# Altium schematic sheet Esquemático.SchDoc
size A4
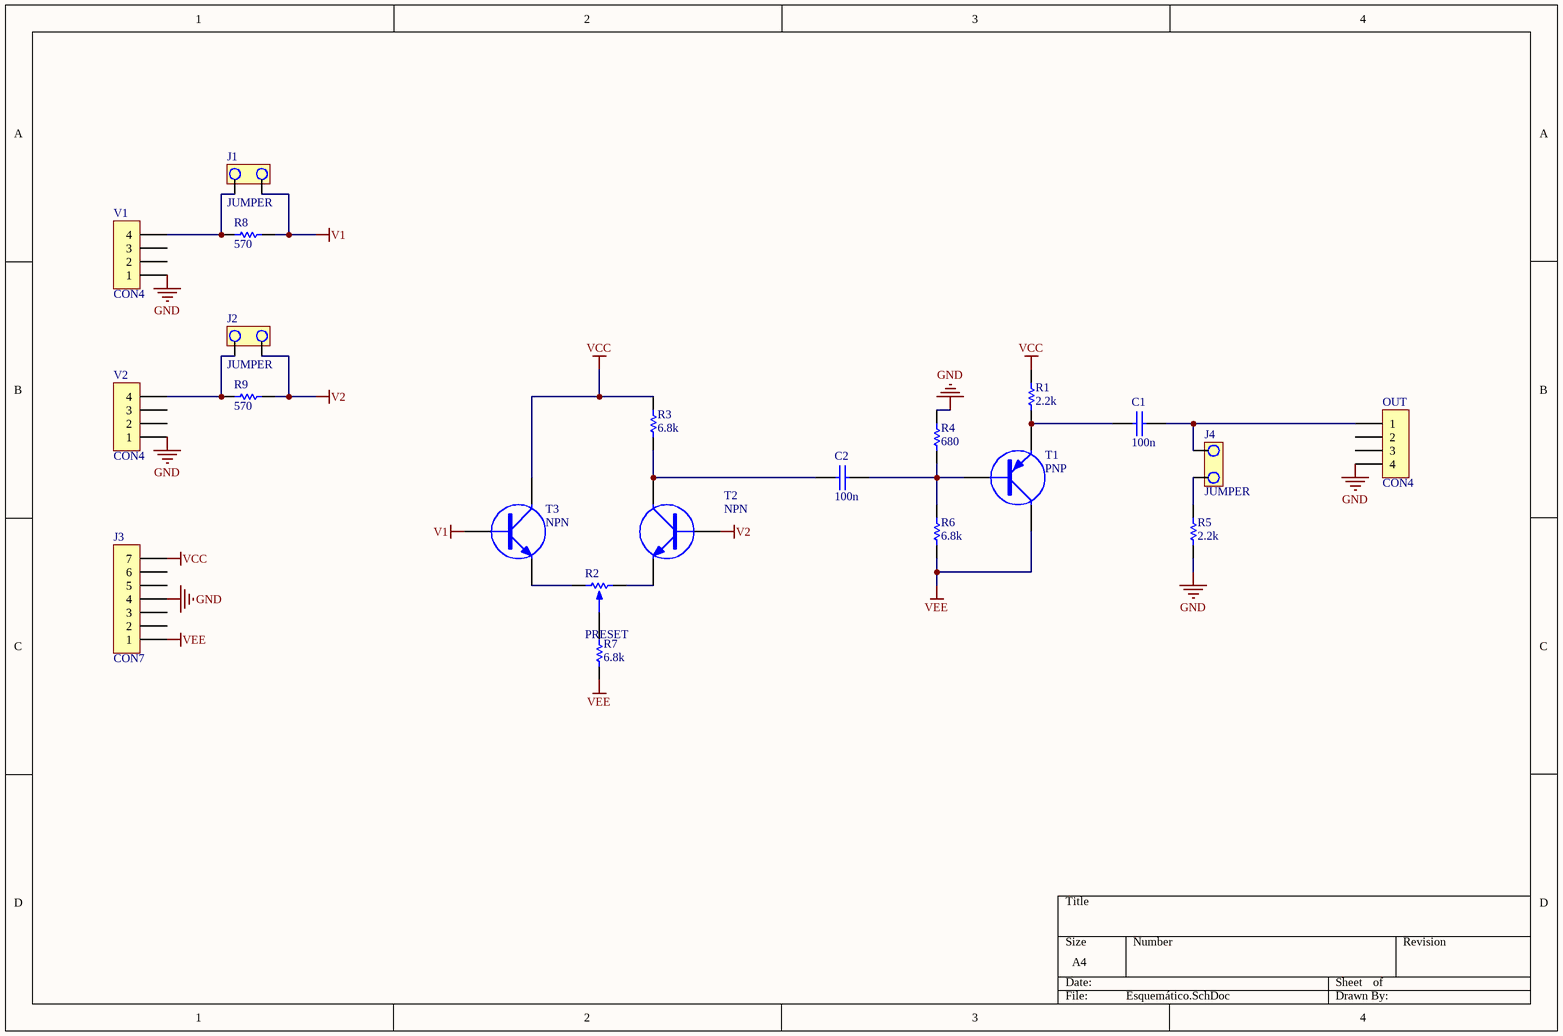
[diagram p0: Esquemático.SchDoc]

## Parts
C1  100n  [CAP200]
C2  100n  [CAP200]
J1  JUMPER  [JUMPER2]
J2  JUMPER  [JUMPER2]
J3  CON7  [SIP7]
J4  JUMPER  [JUMPER2]
OUT  CON4  [SIP4]
R1  2.2k  [RES400]
R2  PRESET  [PRESET V]
R3  6.8k  [RES400]
R4  680  [RES400]
R5  2.2k  [RES400]
R6  6.8k  [RES400]
R7  6.8k  [RES400]
R8  570  [RES400]
R9  570  [RES400]
T1  PNP  [TO92]
T2  NPN  [TO92]
T3  NPN  [TO92]
V1  CON4  [SIP4]
V2  CON4  [SIP4]

## Nets
GND: J3.4 OUT.4 R4.2 R5.1 V1.1 V2.1
V1: J1.1 R8.2 T3.1(B)
V2: J2.1 R9.2 T2.1(B)
VCC: J3.7 R1.2 R3.2 T3.2(C)
VEE: J3.1 R6.1 R7.1 T1.2(C)
NetC1_1: C1.1 R1.1 T1.3(E)
NetC1_2: C1.2 J4.2 OUT.1
NetC2_1: C2.1 R3.1 T2.2(C)
NetC2_2: C2.2 R4.1 R6.2 T1.1(B)
NetJ1_2: J1.2 R8.1 V1.4
NetJ2_2: J2.2 R9.1 V2.4
NetJ4_1: J4.1 R5.2
NetR2_1: R2.1 T2.3(E)
NetR2_2: R2.2 R7.2
NetR2_3: R2.3 T3.3(E)

Not connected (* = marked no-connect by the designer): J3 2 3 5 6; OUT 2 3; V1 2 3; V2 2 3

## Library data of the parts
C1 C2 = CAP
R1 R3-R9 = RES
T1 = TRANSISTOR PNP
T2 T3 = TRANSISTOR NPN